# Altium schematic sheet Power Distribution.SchDoc: Power Distribution
size A4; Author: Miłosz Werner; Organization: Wrocław University of Science and Technology; Revision: 1.0; SheetNumber: 2; SheetTotal: 5
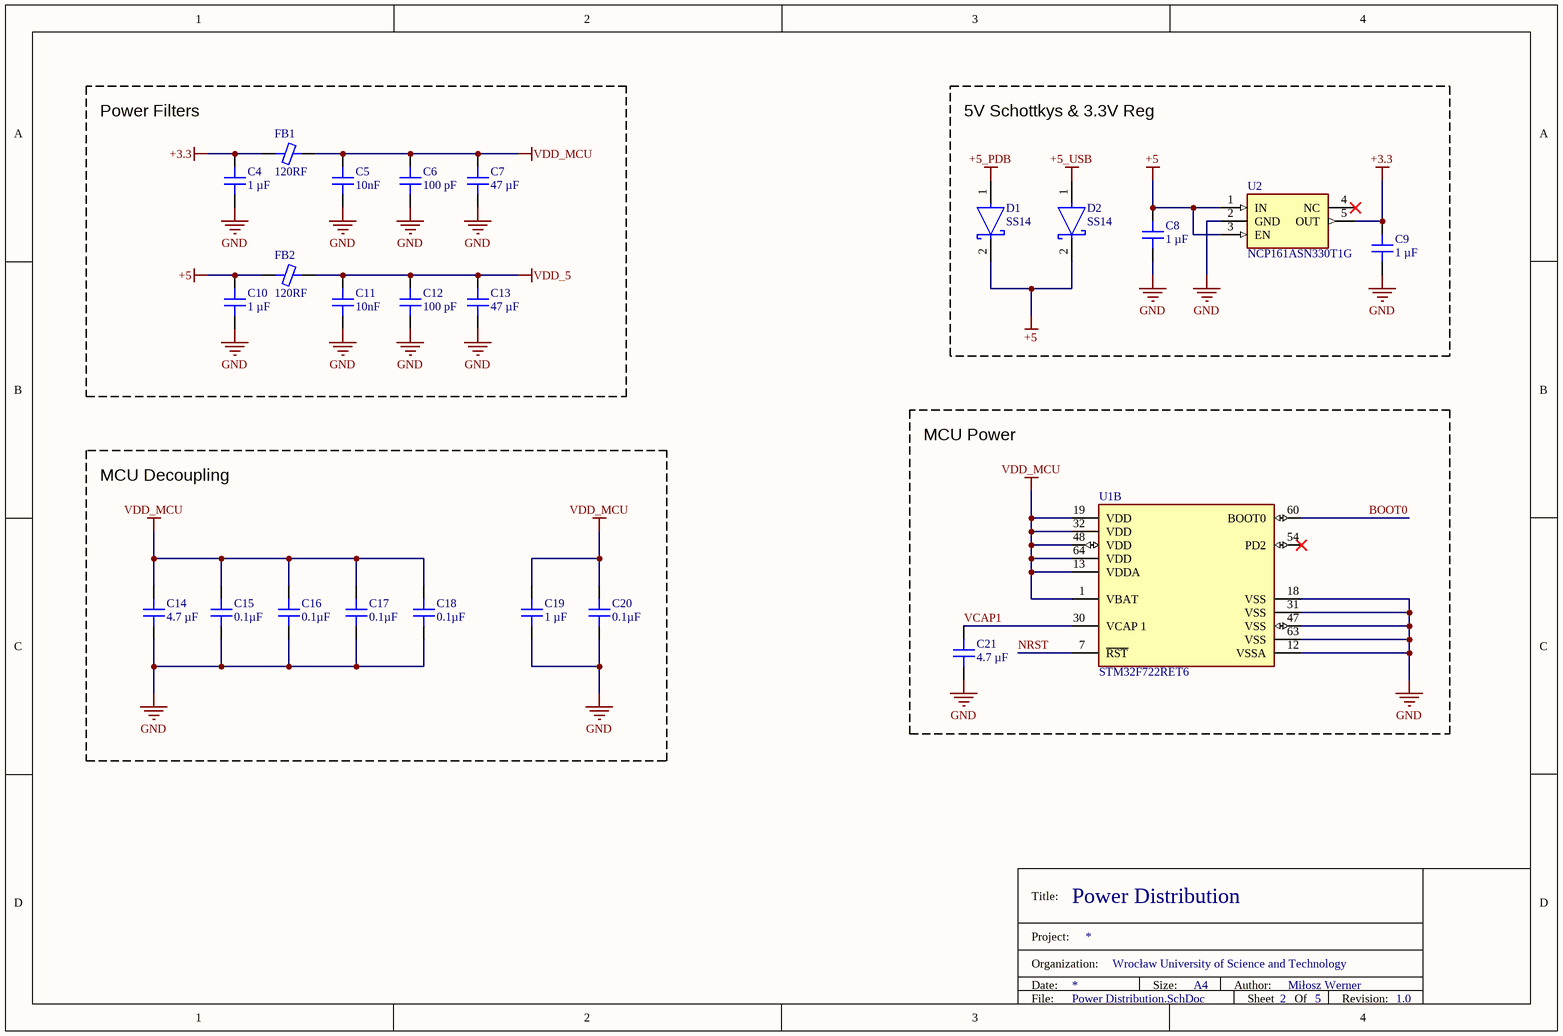
[diagram p0: Power Distribution.SchDoc]

## Parts
C4  1 µF  [CAP 0603_1608]
C5  10nF  [CAP 0603_1608]
C6  100 pF  [CAP 0603_1608]
C7  47 µF  [CAP 0603_1608]
C8  1 µF  [CAP 0603_1608]
C9  1 µF  [CAP 0603_1608]
C10  1 µF  [CAP 0603_1608]
C11  10nF  [CAP 0603_1608]
C12  100 pF  [CAP 0603_1608]
C13  47 µF  [CAP 0603_1608]
C14  4.7 µF  [CAP 0603_1608]
C15  0.1µF  [CAP 0603_1608]
C16  0.1µF  [CAP 0603_1608]
C17  0.1µF  [CAP 0603_1608]
C18  0.1µF  [CAP 0603_1608]
C19  1 µF  [CAP 0603_1608]
C20  0.1µF  [CAP 0603_1608]
C21  4.7 µF  [CAP 0603_1608]
D1  SS14  [FP-403AE-MFG]
D2  SS14  [FP-403AE-MFG]
FB1  120RF  [FER 0603_1608]
FB2  120RF  [FER 0603_1608]
U1  STM32F722RET6  [FP-LQFP64-5W-IPC_A]  (part B of 2)
U2  NCP161ASN330T1G  [SOT95P280X145-5N]

## Blocks framed on the sheet
Power Filters: C4-C7 C10-C13 FB1 FB2
5V Schottkys & 3.3V Reg: C8 C9 D1 D2 U2
MCU Power: C21 U1
MCU Decoupling: C14-C20

## Nets
+3.3: C4.2 C9.2 FB1.1 U2.5(OUT)
+5: C8.2 C10.2 D1.2(C) D2.2(C) FB2.1 U2.1(IN) U2.3(EN)
+5_PDB: D1.1(A)
+5_USB: D2.1(A)
GND: C4.1 C5.1 C6.1 C7.1 C8.1 C9.1 C10.1 C11.1 C12.1 C13.1 C14.1 C15.1 C16.1 C17.1 C18.1 C19.1 C20.1 C21.1 U1.12(VSSA) U1.18(VSS) U1.31(VSS) U1.47(VSS) U1.63(VSS) U2.2(GND)
VDD_5: C11.2 C12.2 C13.2 FB2.2
VDD_MCU: C5.2 C6.2 C7.2 C14.2 C15.2 C16.2 C17.2 C18.2 C19.2 C20.2 FB1.2 U1.1(VBAT) U1.13(VDDA) U1.19(VDD) U1.32(VDD) U1.48(VDD) U1.64(VDD)
BOOT0: U1.60(BOOT0)
NRST: U1.7(~{RST})
VCAP1: C21.2 U1.30(VCAP_1)

Not connected (* = marked no-connect by the designer): U1 54(PD2)*; U2 4(NC)*

## Notes on the sheet
- Title:
- Date:
- File:
- Project:
- Organization:
- Size:
- A4
- Author:
- Sheet
- Of
- Revision:

## Library data of the parts
C4 C8-C10 C19 = CL10A105KA8NFNC: CAP CER 1UF 25V X5R 0603; manufacturer: Samsung Electro-Mechanics; Tolerance: ±10%; Part Number: CL10A105KA8NFNC; Value: 1 µF; Applications: General Purpose; Capacitance: 1 µF; componentlink1description: Datasheet; componentlink1url: http://www.samsungsem.com/kr/support/product-search/mlcc/CL10A105KA8NFNC.jsp; componentlink2description: DigiKey Link; componentlink2url: https://www.digikey.com/en/products/detail/samsung-electro-mechanics/CL10A105KA8NFNC/3887517; Device Package: 0603 (1608 Metric); lastupdated: 19.09.2022 13:00:45; Lifecycle Status: Active; Minimum Order: 1; Mounting Type: Surface Mount, MLCC; Operating Temperature: -55°C ~ 85°C; Package / Case: 0603 (1608 Metric); packaging: TapeAndReel; partid: 14268; Part Status: Active; price: 0.01; series: CL; Size / Dimension: 0.063" L x 0.031" W (1.60mm x 0.80mm); Supplier 1: DigiKey; Supplier Part Number 1: 1276-1859-1-ND; Temperature Coefficient: X5R; Thickness (Max): 0.035" (0.90mm); Voltage - Rated: 25V
C5 C11 = 06033C103KAT2A: CAP CER 10000PF 25V X7R 0603; manufacturer: AVX Corporation; Tolerance: ±10%; Part Number: 06033C103KAT2A; Value: 10nF; Applications: General Purpose; Capacitance: 10000pF; componentlink1description: Datasheet; componentlink1url: http://datasheets.avx.com/X7RDielectric.pdf; componentlink2description: DigiKey Link; componentlink2url: http://digikey.com/product-detail/en/avx-corporation/06033C103KAT2A/478-7902-1-ND/3881525; Device Package: 0603 (1608 Metric); lastupdated: 02.09.2020 01:03:14; Lifecycle Status: Active; Minimum Order: 1; Mounting Type: Surface Mount, MLCC; Operating Temperature: -55°C ~ 125°C; Package / Case: 0603 (1608 Metric); packaging: TapeAndReel; partid: 14146; Part Status: Active; price: 0.04; series: -; Size / Dimension: 0.063" L x 0.032" W (1.60mm x 0.81mm); Supplier 1: DigiKey; Supplier Part Number 1: 478-7902-1-ND; Temperature Coefficient: X7R; Thickness (Max): 0.035" (0.90mm); Voltage - Rated: 25V
C6 C12 = C0603C101K8RAC7867: CAP CER 100PF 10V X7R 0603; manufacturer: KEMET; Tolerance: ±10%; Part Number: C0603C101K8RAC7867; Value: 100 pF; Applications: Bypass, Decoupling; Capacitance: 100 pF; componentlink1description: Datasheet; componentlink1url: https://api.kemet.com/component-edge/download/datasheet/C0603C101K8RAC7867.pdf; componentlink2description: DigiKey Link; componentlink2url: https://www.digikey.com/en/products/detail/kemet/C0603C101K8RAC7867/7382054; Device Package: 0603 (1608 Metric); lastupdated: 15.07.2022 11:28:44; Lifecycle Status: Active; Minimum Order: 1; Mounting Type: Surface Mount, MLCC; Operating Temperature: -55°C ~ 125°C; Package / Case: 0603 (1608 Metric); packaging: TapeAndReel; partid: 17919; Part Status: Active; price: 0.04; series: SMD Comm X7R; Size / Dimension: 0.063" L x 0.031" W (1.60mm x 0.80mm); Supplier 1: DigiKey; Supplier Part Number 1: 399-14938-1-ND; Temperature Coefficient: X7R; Thickness (Max): 0.034" (0.87mm); Voltage - Rated: 10V
C7 C13 = GRM188R60J476ME15D: CAP CER 47UF 6.3V X5R 0603; manufacturer: Murata Electronics; Tolerance: ±20%; Part Number: GRM188R60J476ME15D; Value: 47 µF; Applications: General Purpose; Capacitance: 47 µF; componentlink1description: Datasheet; componentlink1url: https://www.murata.com/~/media/webrenewal/support/library/catalog/products/capacitor/mlcc/c02e.ashx?la=en-us; componentlink2description: DigiKey Link; componentlink2url: https://www.digikey.com/en/products/detail/murata-electronics/GRM188R60J476ME15D/5877410; Device Package: 0603 (1608 Metric); lastupdated: 15.07.2022 11:29:22; Lifecycle Status: Active; Minimum Order: 1; Mounting Type: Surface Mount, MLCC; Operating Temperature: -55°C ~ 85°C; Package / Case: 0603 (1608 Metric); packaging: TapeAndReel; partid: 5468; Part Status: Active; price: 0.11; series: GRM; Size / Dimension: 0.063" L x 0.031" W (1.60mm x 0.80mm); Supplier 1: DigiKey; Supplier Part Number 1: 490-13247-1-ND; Temperature Coefficient: X5R; Thickness (Max): 0.039" (1.00mm); Voltage - Rated: 6.3V
C14 C21 = GRM188R61E475KE11D: CAP CER 4.7UF 25V X5R 0603; manufacturer: Murata Electronics; Tolerance: ±10%; Part Number: GRM188R61E475KE11D; Value: 4.7 µF; Applications: General Purpose; Capacitance: 4.7 µF; componentlink1description: Datasheet; componentlink1url: https://www.murata.com/~/media/webrenewal/support/library/catalog/products/capacitor/mlcc/c02e.ashx?la=en-us; componentlink2description: DigiKey Link; componentlink2url: https://www.digikey.com/en/products/detail/murata-electronics/GRM188R61E475KE11D/3900465; Device Package: 0603 (1608 Metric); lastupdated: 19.09.2022 13:01:19; Lifecycle Status: Active; Minimum Order: 1; Mounting Type: Surface Mount, MLCC; Operating Temperature: -55°C ~ 85°C; Package / Case: 0603 (1608 Metric); packaging: TapeAndReel; partid: 2387; Part Status: Active; price: 0.05; series: GRM; Size / Dimension: 0.063" L x 0.031" W (1.60mm x 0.80mm); Supplier 1: DigiKey; Supplier Part Number 1: 490-7203-1-ND; Temperature Coefficient: X5R; Thickness (Max): 0.037" (0.95mm); Voltage - Rated: 25V
C15-C18 C20 = 06033C104JAT4A: CAP CER 0.1UF 25V X7R 0603; manufacturer: AVX Corporation; Tolerance: ±5%; Part Number: 06033C104JAT4A; Value: 0.1µF; Applications: General Purpose; Capacitance: 0.1µF; componentlink1description: Datasheet; componentlink1url: http://datasheets.avx.com/X7RDielectric.pdf; componentlink2description: DigiKey Link; componentlink2url: http://digikey.com/product-detail/en/avx-corporation/06033C104JAT4A/478-11510-1-ND/8107711; Device Package: 0603 (1608 Metric); lastupdated: 02.09.2020 01:03:22; Lifecycle Status: Active; Minimum Order: 1; Mounting Type: Surface Mount, MLCC; Operating Temperature: -55°C ~ 125°C; Package / Case: 0603 (1608 Metric); packaging: TapeAndReel; partid: 10083; Part Status: Active; price: 0.06; series: -; Size / Dimension: 0.063" L x 0.032" W (1.60mm x 0.81mm); Supplier 1: DigiKey; Supplier Part Number 1: 478-11510-1-ND; Temperature Coefficient: X7R; Thickness (Max): 0.035" (0.90mm); Voltage - Rated: 25V
D1 D2 = CMP-2000-04943-2: DIODE SCHOTTKY 40V 1A SMA; Manufacturer: ON Semiconductor; Peak Reverse Current: 0.2mA; Max Junction Temp: +125°C; Standoff Height: 0.05mm; Max Surge Forward Current: 40A; Mouser Description: Schottky Diodes & Rectifiers SMA 40V 1.0A; RoHS: TRUE; Lead Free: Yes; Manufacturer Part Number: SS14; Device Class L3: Schottky Diodes; Category: Diode; Automotive: No; Digikey Description: DIODE SCHOTTKY 40V 1A SMA; ComponentLink2Description: Datasheet; Device Class L2: Diodes; Height: 2.5mm; Temperature Range High: +125°C; ComponentLink2URL: https://www.onsemi.com/pub/Collateral/SS19-D.PDF; Device Class L1: Discrete Semiconductors; Package: 403AE; Octopart: https://octopart.com/ss14-on+semiconductor-29205033; Max Repetitive Reverse Voltage: 40V; Temperature Range Low: -65°C; Forward Current: 1A; Temperature: -65°C to +125°C
FB1 FB2 = BLM18PG121SN1D: FERRITE BEAD 120 OHM 0603 1LN; Manufacturer: Murata Electronics; Current Rating (Max): 2A; DC Resistance (DCR) (Max): 50mOhm; Filter Type: Power Line; Impedance @ Frequency: 120 Ohms @ 100 MHz; Number of Lines: 1; Value: 120 Ohms @ 100 MHz; Part Number: BLM18PG121SN1D; ComponentLink1Description: Datasheet; ComponentLink1URL: https://www.murata.com/en-us/products/productdata/8796738650142/ENFA0003.pdf; ComponentLink2Description: DigiKey Link; ComponentLink2URL: https://www.digikey.com/en/products/detail/murata-electronics/BLM18PG121SN1D/584248; Device Package: 0603 (1608 Metric); Height (Max): 0.037" (0.95mm); LastUpdated: 19.09.2022 13:43:58; Lifecycle Status: Active; Minimum Order: 1; Mounting Type: Surface Mount; Operating Temperature: -55°C ~ 125°C; Package / Case: 0603 (1608 Metric); Packaging: TapeAndReel; PartId: 853; Part Status: Active; Price: 0.02; Series: EMIFIL®, BLM18; Size / Dimension: 0.063" L x 0.032" W (1.60mm x 0.80mm); Supplier 1: DigiKey; Supplier Part Number 1: 490-1037-1-ND
U1 = CMP-12105-000139-1: IC MCU 32BIT 512KB FLASH 64LQFP; Interface: I2C; Number of I/Os: 50; Peripherals: Brown-out Detect/Reset; Core Architecture: ARM; Oscillator Type: Internal; Frequency: 216MHz; Memory Size: 512KB; Min Operating Temperature: -40°C; Max Operating Temperature: 85°C; Mount: Surface Mount; Case/Package: LQFP; Memory Type: FLASH; Packaging: Tray
U2 = NCP161ASN330T1G: Power Supply; Manufacturer_Name: onsemi; Datasheet Link: https://componentsearchengine.com/Datasheets/2/NCP161ASN330T1G.pdf; Height: 1.45mm; Manufacturer_Part_Number: NCP161ASN330T1G; Mouser Part Number: 863-NCP161ASN330T1G; Mouser Price/Stock: https://www.mouser.co.uk/ProductDetail/onsemi/NCP161ASN330T1G?qs=vLWxofP3U2ze5zA%252BHmAd3w%3D%3D; Arrow Part Number: NCP161ASN330T1G; Arrow Price/Stock: https://www.arrow.com/en/products/ncp161asn330t1g/on-semiconductor?region=nac